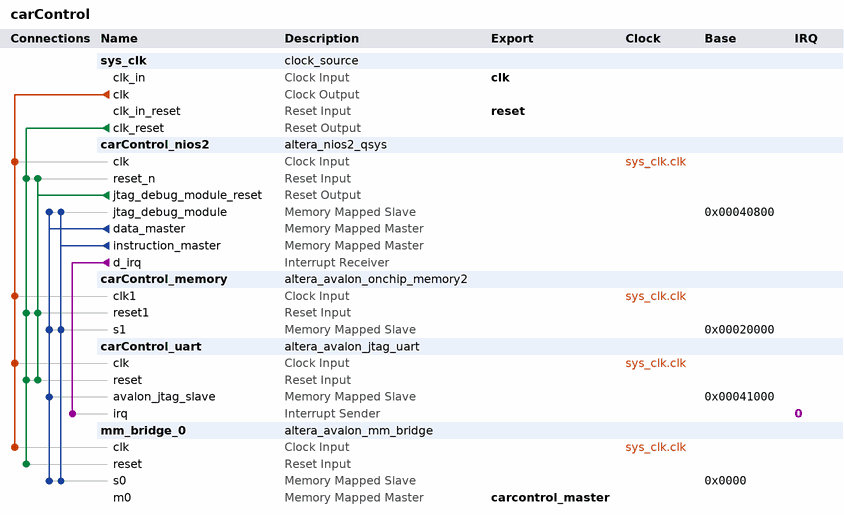
[diagram p0: system contents]
# Platform Designer (Qsys) system carControl, Cyclone IV E EP4CE115F29C7
# Parameters at their usual value, and those the tool derives, are not listed.
package require -exact qsys 12.1
create_system carControl
set_project_property DEVICE_FAMILY {Cyclone IV E}
set_project_property DEVICE EP4CE115F29C7

add_instance sys_clk clock_source 12.1
set_instance_parameter_value sys_clk clockFrequency 100000000

add_instance carControl_nios2 altera_nios2_qsys 12.1
set_instance_parameter_value carControl_nios2 resetSlave carControl_memory.s1
set_instance_parameter_value carControl_nios2 exceptionSlave carControl_memory.s1
set_instance_parameter_value carControl_nios2 breakSlave carControl_nios2.jtag_debug_module
set_instance_parameter_value carControl_nios2 impl Small
set_instance_parameter_value carControl_nios2 icache_size 4096

add_instance carControl_memory altera_avalon_onchip_memory2 12.1
set_instance_parameter_value carControl_memory dataWidth 32
set_instance_parameter_value carControl_memory dualPort false
set_instance_parameter_value carControl_memory initMemContent true
set_instance_parameter_value carControl_memory initializationFileName carControl_memory
set_instance_parameter_value carControl_memory memorySize 102400

add_instance carControl_uart altera_avalon_jtag_uart 12.1
set_instance_parameter_value carControl_uart allowMultipleConnections true
set_instance_parameter_value carControl_uart simInteractiveOptions INTERACTIVE_INPUT_OUTPUT

add_instance mm_bridge_0 altera_avalon_mm_bridge 12.1
set_instance_parameter_value mm_bridge_0 DATA_WIDTH 32
set_instance_parameter_value mm_bridge_0 ADDRESS_WIDTH 10
set_instance_parameter_value mm_bridge_0 ADDRESS_UNITS SYMBOLS
set_instance_parameter_value mm_bridge_0 MAX_PENDING_RESPONSES 4

# connections
add_connection sys_clk.clk carControl_memory.clk1 clock
add_connection sys_clk.clk carControl_nios2.clk clock
add_connection sys_clk.clk carControl_uart.clk clock
add_connection sys_clk.clk mm_bridge_0.clk clock
add_connection carControl_nios2.jtag_debug_module_reset carControl_memory.reset1 reset
add_connection carControl_nios2.jtag_debug_module_reset carControl_nios2.reset_n reset
add_connection carControl_nios2.jtag_debug_module_reset carControl_uart.reset reset
add_connection sys_clk.clk_reset carControl_memory.reset1 reset
add_connection sys_clk.clk_reset carControl_nios2.reset_n reset
add_connection sys_clk.clk_reset carControl_uart.reset reset
add_connection sys_clk.clk_reset mm_bridge_0.reset reset
add_connection carControl_nios2.data_master carControl_memory.s1 avalon
set_connection_parameter_value carControl_nios2.data_master/carControl_memory.s1 baseAddress 0x00020000
add_connection carControl_nios2.data_master carControl_nios2.jtag_debug_module avalon
set_connection_parameter_value carControl_nios2.data_master/carControl_nios2.jtag_debug_module baseAddress 0x00040800
add_connection carControl_nios2.data_master carControl_uart.avalon_jtag_slave avalon
set_connection_parameter_value carControl_nios2.data_master/carControl_uart.avalon_jtag_slave baseAddress 0x00041000
add_connection carControl_nios2.data_master mm_bridge_0.s0 avalon
set_connection_parameter_value carControl_nios2.data_master/mm_bridge_0.s0 baseAddress 0x0000
add_connection carControl_nios2.instruction_master carControl_memory.s1 avalon
set_connection_parameter_value carControl_nios2.instruction_master/carControl_memory.s1 baseAddress 0x00020000
add_connection carControl_nios2.instruction_master carControl_nios2.jtag_debug_module avalon
set_connection_parameter_value carControl_nios2.instruction_master/carControl_nios2.jtag_debug_module baseAddress 0x00040800
add_connection carControl_nios2.instruction_master mm_bridge_0.s0 avalon
set_connection_parameter_value carControl_nios2.instruction_master/mm_bridge_0.s0 baseAddress 0x0000
add_connection carControl_nios2.d_irq carControl_uart.irq interrupt
set_connection_parameter_value carControl_nios2.d_irq/carControl_uart.irq irqNumber 0

# exported interfaces
add_interface clk clock sink
set_interface_property clk EXPORT_OF sys_clk.clk_in
add_interface reset reset sink
set_interface_property reset EXPORT_OF sys_clk.clk_in_reset
add_interface carcontrol_master avalon master
set_interface_property carcontrol_master EXPORT_OF mm_bridge_0.m0

save_system carControl.qsys
